# EAGLE design BMS Schematic (EAGLE 8.4.1)

## Sheet 1 of 3
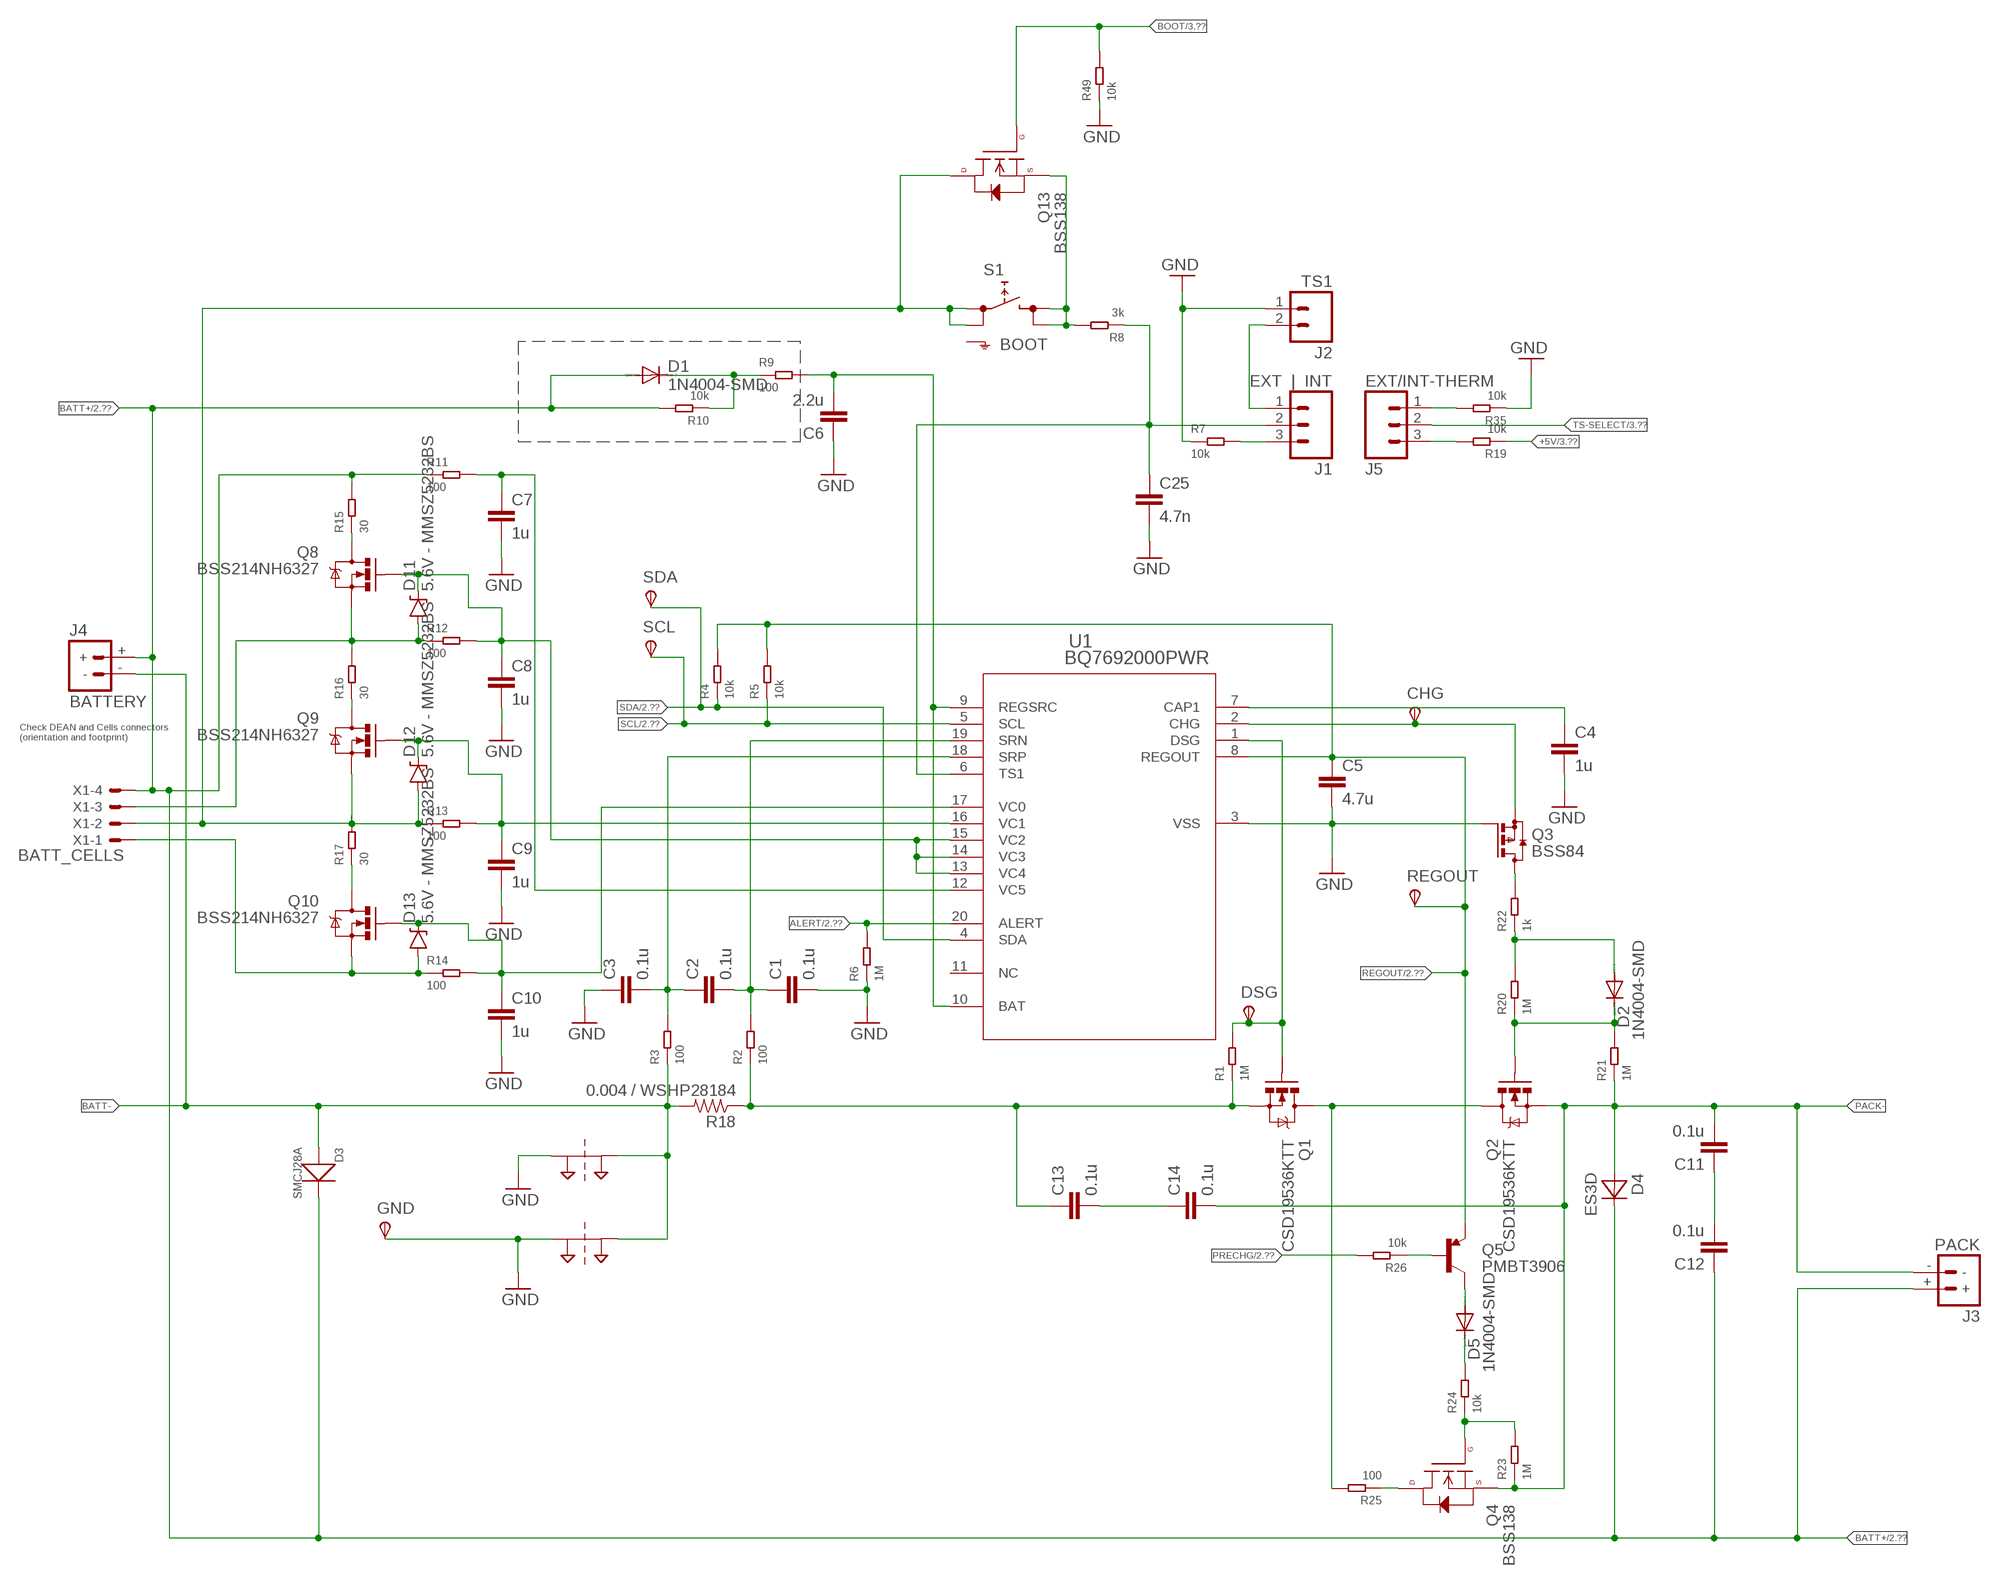
[diagram p0: schematic, sheet 1]

### Parts
C1  0.1u  CAP0805  [0805]
C2  0.1u  CAP0805  [0805]
C3  0.1u  CAP0805  [0805]
C4  1u  CAP0805  [0805]
C5  4.7u  CAP0805  [0805]
C6  2.2u  C-EUC1206  [C1206]
C7  1u  CAP0805  [0805]
C8  1u  CAP0805  [0805]
C9  1u  CAP0805  [0805]
C10  1u  CAP0805  [0805]
C11  0.1u  CAP0805  [0805]
C12  0.1u  CAP0805  [0805]
C13  0.1u  CAP0805  [0805]
C14  0.1u  CAP0805  [0805]
C25  4.7n  CAP0805  [0805]
CHG  TPSB2,54  [B2,54]
D1  1N4004-SMD  [DO-214]
D2  1N4004-SMD  [DO-214]
D3  SMCJ28A  SMD-DIODE-SCHOTTKY-40V-3A(DO-214AB)  [DO-214AB]
D4  ES3D  [SMC]
D5  1N4004-SMD  [DO-214]
D11  5.6V - MMSZ5232BS  DIODE-ZENER5.6V  [SOD-323]
D12  5.6V - MMSZ5232BS  DIODE-ZENER5.6V  [SOD-323]
D13  5.6V - MMSZ5232BS  DIODE-ZENER5.6V  [SOD-323]
DSG  TPSB2,54  [B2,54]
GND  GND  TPSPAD1-17  [P1-17]
J1  EXT | INT  M03PTH  [1X03]
J2  TS1  M02PTH  [1X02]
J3  PACK  BATTERY_CONNDEANS  [DEANS]
J4  BATTERY  BATTERY_CONNDEANS  [DEANS]
J5  EXT/INT-THERM  M03PTH  [1X03]
PT1  2PT_GND_TIE  [2PT_GND_TIE]
PT2  2PT_GND_TIE  [2PT_GND_TIE]
Q1  CSD19536KTT  MOSFET-NCHANNELPSMN7R0  [TO-263/D2PAK]
Q2  CSD19536KTT  MOSFET-NCHANNELPSMN7R0  [TO-263/D2PAK]
Q3  BSS84  [SOT23]
Q4  BSS138  N-CHANNEL-MOSFET-BSS138  [SOT23-3]
Q5  PMBT3906  TRANSISTOR_PNPPMBT3906  [SOT23-3]
Q8  BSS214NH6327  MOSFET-NCHANNELBSS138  [SOT23-3]
Q9  BSS214NH6327  MOSFET-NCHANNELBSS138  [SOT23-3]
Q10  BSS214NH6327  MOSFET-NCHANNELBSS138  [SOT23-3]
Q13  BSS138  N-CHANNEL-MOSFET-BSS138  [SOT23-3]
R1  1M  RES-0805  [R0805]
R2  100  RES-0805  [R0805]
R3  100  RES-0805  [R0805]
R4  10k  RES-0805  [R0805]
R5  10k  RES-0805  [R0805]
R6  1M  RES-0805  [R0805]
R7  10k  RES-0805  [R0805]
R8  3k  RES-0805  [R0805]
R9  100  RES-0805  [R0805]
R10  10k  RES-0805  [R0805]
R11  100  RES-0805  [R0805]
R12  100  RES-0805  [R0805]
R13  100  RES-0805  [R0805]
R14  100  RES-0805  [R0805]
R15  30  RES-2512  [R2512]
R16  30  RES-2512  [R2512]
R17  30  RES-2512  [R2512]
R18  0.004 / WSHP28184  0.001OHM-3W-1%(2512)3W/1%  [2512]
R19  10k  RES-0805  [R0805]
R20  1M  RES-0805  [R0805]
R21  1M  RES-0805  [R0805]
R22  1k  RES-0805  [R0805]
R23  1M  RES-0805  [R0805]
R24  10k  RES-0805  [R0805]
R25  100  RES-2512  [R2512]
R26  10k  RES-0805  [R0805]
R35  10k  RES-0805  [R0805]
R49  10k  RES-0805  [R0805]
REGOUT  TPSB2,54  [B2,54]
S1  BOOT  SKHMPSE010  [SKHMPXE010]
SCL  TPSB2,54  [B2,54]
SDA  TPSB2,54  [B2,54]
U1  BQ7692000PWR  BQ7692006PWR  [PW20]
X1  BATT_CELLS  C-GRID-04-70543  [70543-04]

### Nets
+5V: R19.1 ; also sheet 3
ALERT: R6.2 U1.20(ALERT) ; also sheet 2
BATT+: C12.1 D1.A D3.2(-) D4.C J3.+ J4.+ R10.2 R11.1 R15.2 X1.4 ; also sheet 2,3
BATT-: D3.1(+) J4.- PT1.P$2 PT2.P$2 R3.1 R18.2
BOOT: Q13.1(G) R49.2 ; also sheet 3
CHG: CHG.TP(PP) Q3.2(S) U1.2(CHG)
DSG: DSG.TP(PP) Q1.1(G) R1.2 U1.1(DSG)
DSG-CHG: Q1.2(D) Q2.2(D) R25.2
GND: C1.2 C3.1 C4.2 C5.2 C6.1 C7.2 C8.2 C9.2 C10.2 C25.2 GND.TP(PP) J2.1 PT1.P$1 PT2.P$1 Q3.1(G) R6.1 R7.1 R35.1 R49.1 U1.3(VSS) ; also sheet 2,3
N$1: C2.1 C3.2 R3.2 U1.18(SRP)
N$2: C1.1 C2.2 R2.2 U1.19(SRN)
N$3: C25.1 J1.2 R8.1 U1.6(TS1)
N$4: C6.2 R9.2 U1.9(REGSRC) U1.10(BAT)
N$5: C4.1 U1.7(CAP1)
N$8: J1.1 J2.2
N$9: J1.3 R7.2
N$10: D1.C R9.1 R10.1
N$11: Q13.2(S) R8.2 S1.3(2.1) S1.4(2.2)
N$12: D13.A Q10.2(S) R14.1 X1.1
N$13: C7.1 R11.2 U1.12(VC5)
N$14: Q8.3(D) R15.1
N$16: C10.1 D13.C Q10.1(G) R14.2 U1.17(VC0)
N$17: J5.3 R19.2
N$18: D11.A Q8.2(S) R12.1 R16.2 X1.3
N$19: Q9.3(D) R16.1
N$20: D2.C Q2.1(G) R20.1 R21.2
N$21: C8.1 D11.C Q8.1(G) R12.2 U1.13(VC4) U1.14(VC3) U1.15(VC2)
N$22: Q10.3(D) R17.1
N$24: C11.1 C12.2
N$26: D2.A R20.2 R22.1
N$27: D12.A Q9.2(S) Q13.3(D) R13.1 R17.2 S1.1(1.1) S1.2(1.2) X1.2
N$28: Q3.3(D) R22.2
N$29: C13.2 C14.1
N$30: Q4.1(G) R23.2 R24.1
N$31: D5.C R24.2
N$32: D5.A Q5.3(C)
N$33: Q5.1(B) R26.1
N$34: Q4.3(D) R25.1
N$57: J5.1 R35.2
N$67: C9.1 D12.C Q9.1(G) R13.2 U1.16(VC1)
PACK-: C11.2 C14.2 D4.A J3.- Q2.3(S) Q4.2(S) R21.1 R23.1
PRECHG: R26.2 ; also sheet 2
REGOUT: C5.1 Q5.2(E) R4.2 R5.2 REGOUT.TP(PP) U1.8(REGOUT) ; also sheet 2,3
RSNS-DSG: C13.1 Q1.3(S) R1.1 R2.1 R18.1
SCL: R5.1 SCL.TP(PP) U1.5(SCL) ; also sheet 2
SDA: R4.1 SDA.TP(PP) U1.4(SDA) ; also sheet 2
TS-SELECT: J5.2 ; also sheet 3
Unconnected: S1.5(SH) U1.11(NC)

### Notes on the sheet
- Check DEAN and Cells connectors 
  (orientation and footprint)

## Sheet 2 of 3
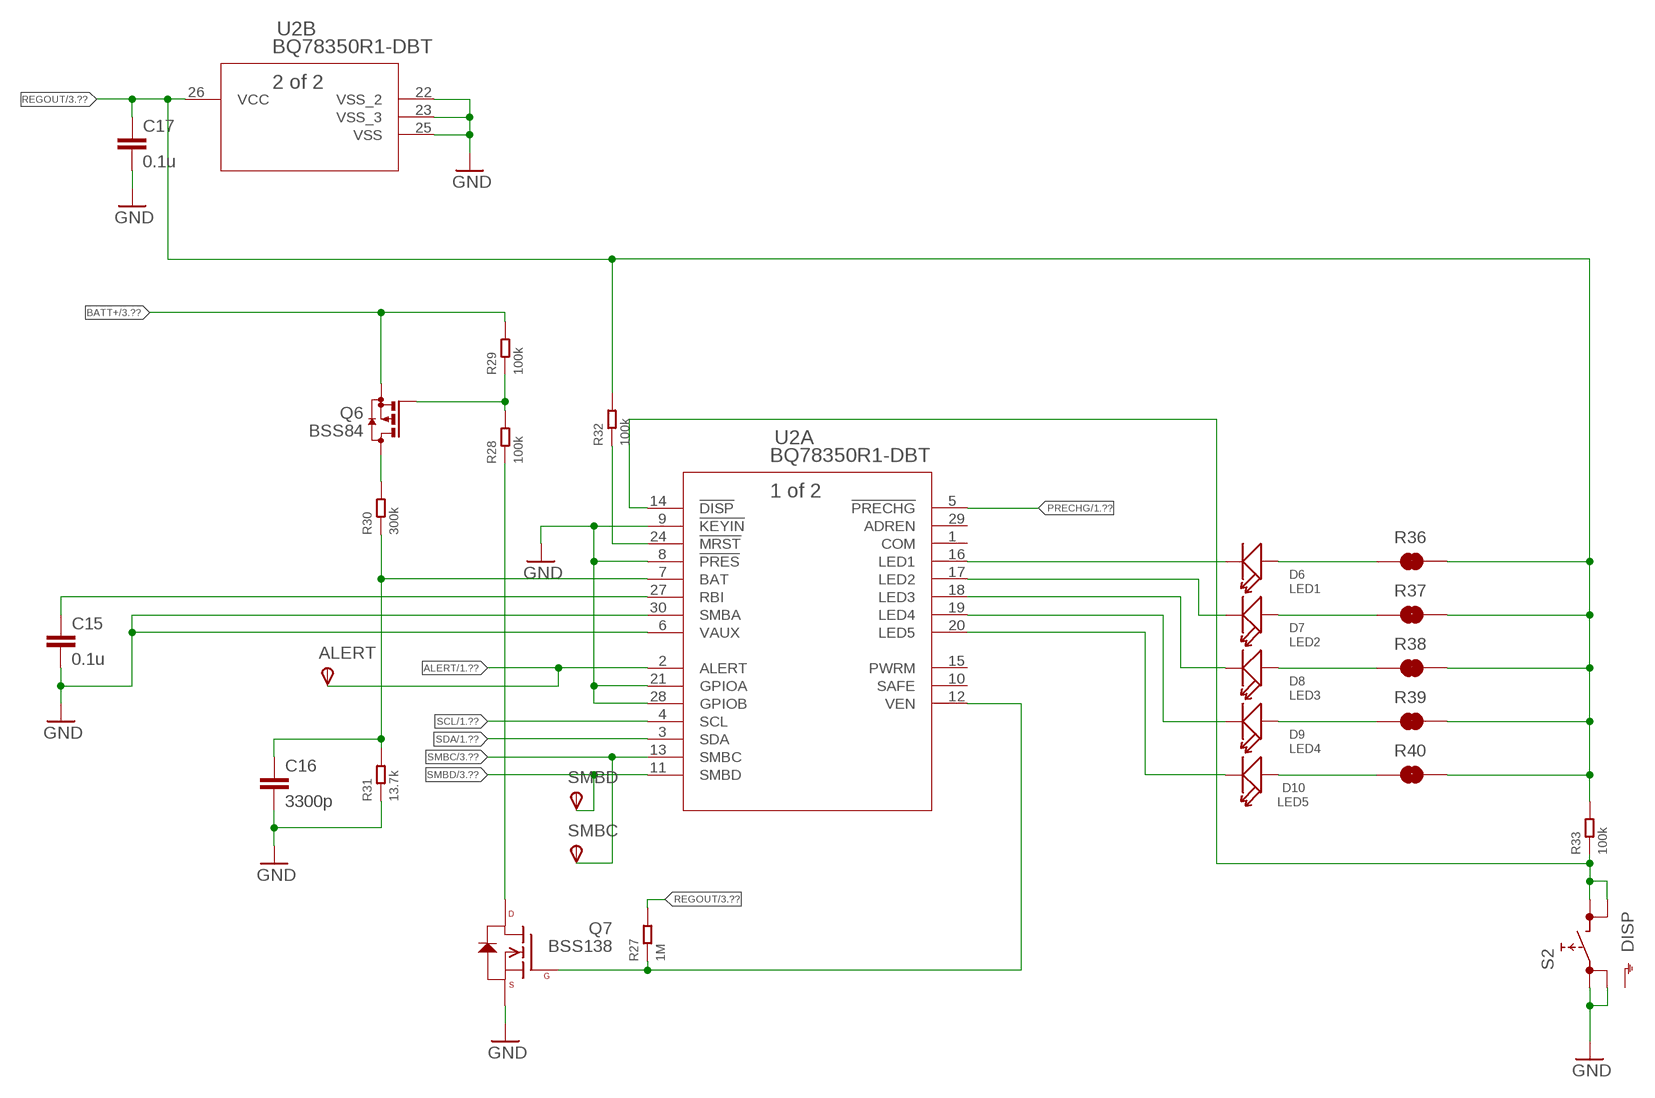
[diagram p1: schematic, sheet 2]

### Parts
ALERT  TPSB2,54  [B2,54]
C15  0.1u  CAP0805  [0805]
C16  3300p  CAP0805  [0805]
C17  0.1u  CAP0805  [0805]
D6  LED1  SMD-LED-CLEAR-GREEN(0805)  [LED-0805]
D7  LED2  SMD-LED-CLEAR-GREEN(0805)  [LED-0805]
D8  LED3  SMD-LED-CLEAR-GREEN(0805)  [LED-0805]
D9  LED4  SMD-LED-CLEAR-GREEN(0805)  [LED-0805]
D10  LED5  SMD-LED-CLEAR-RED(0805)  [LED-0805]
Q6  BSS84  [SOT23]
Q7  BSS138  N-CHANNEL-MOSFET-BSS138  [SOT23-3]
R27  1M  RES-0805  [R0805]
R28  100k  RES-0805  [R0805]
R29  100k  RES-0805  [R0805]
R30  300k  RES-0805  [R0805]
R31  13.7k  RES-0805  [R0805]
R32  100k  RES-0805  [R0805]
R33  100k  RES-0805  [R0805]
R36  JUMPER-NC-0805  [R0805]
R37  JUMPER-NC-0805  [R0805]
R38  JUMPER-NC-0805  [R0805]
R39  JUMPER-NC-0805  [R0805]
R40  JUMPER-NC-0805  [R0805]
S2  DISP  SKHMPSE010  [SKHMPXE010]
SMBC  TPSB2,54  [B2,54]
SMBD  TPSB2,54  [B2,54]
U2  BQ78350R1-DBT  [DBT30]

### Nets
ALERT: ALERT.TP(PP) U2.2(A:ALERT) ; also sheet 1
BATT+: Q6.2(S) R29.2 ; also sheet 1,3
GND: C15.2 C16.2 C17.2 Q7.2(S) R31.1 S2.1(1.1) S2.2(1.2) U2.6(A:VAUX) U2.8(A:!PRES) U2.9(A:!KEYIN) U2.21(A:GPIOA) U2.22(B:VSS_2) U2.23(B:VSS_3) U2.25(B:VSS) U2.28(A:GPIOB) U2.30(A:SMBA) ; also sheet 1,3
N$23: C15.1 U2.27(A:RBI)
N$35: Q7.1(G) R27.1 U2.12(A:VEN)
N$36: Q7.3(D) R28.1
N$37: Q6.1(G) R28.2 R29.1
N$38: Q6.3(D) R30.2
N$39: C16.1 R30.1 R31.2 U2.7(A:BAT)
N$40: R32.1 U2.24(A:!MRST)
N$41: D6.- U2.16(A:LED1)
N$42: D7.- U2.17(A:LED2)
N$43: D8.- U2.18(A:LED3)
N$44: D9.- U2.19(A:LED4)
N$45: D10.- U2.20(A:LED5)
N$46: D6.+ R36.1
N$47: D7.+ R37.1
N$48: R33.1 S2.3(2.1) S2.4(2.2) U2.14(A:!DISP)
N$49: D8.+ R38.1
N$50: D9.+ R39.1
N$51: D10.+ R40.1
PRECHG: U2.5(A:!PRECHG) ; also sheet 1
REGOUT: C17.1 R27.2 R32.2 R33.2 R36.2 R37.2 R38.2 R39.2 R40.2 U2.26(B:VCC) ; also sheet 1,3
SCL: U2.4(A:SCL) ; also sheet 1
SDA: U2.3(A:SDA) ; also sheet 1
SMBC: SMBC.TP(PP) U2.13(A:SMBC) ; also sheet 3
SMBD: SMBD.TP(PP) U2.11(A:SMBD) ; also sheet 3
Unconnected: S2.5(SH) U2.1(A:COM) U2.10(A:SAFE) U2.15(A:PWRM) U2.29(A:ADREN)

## Sheet 3 of 3
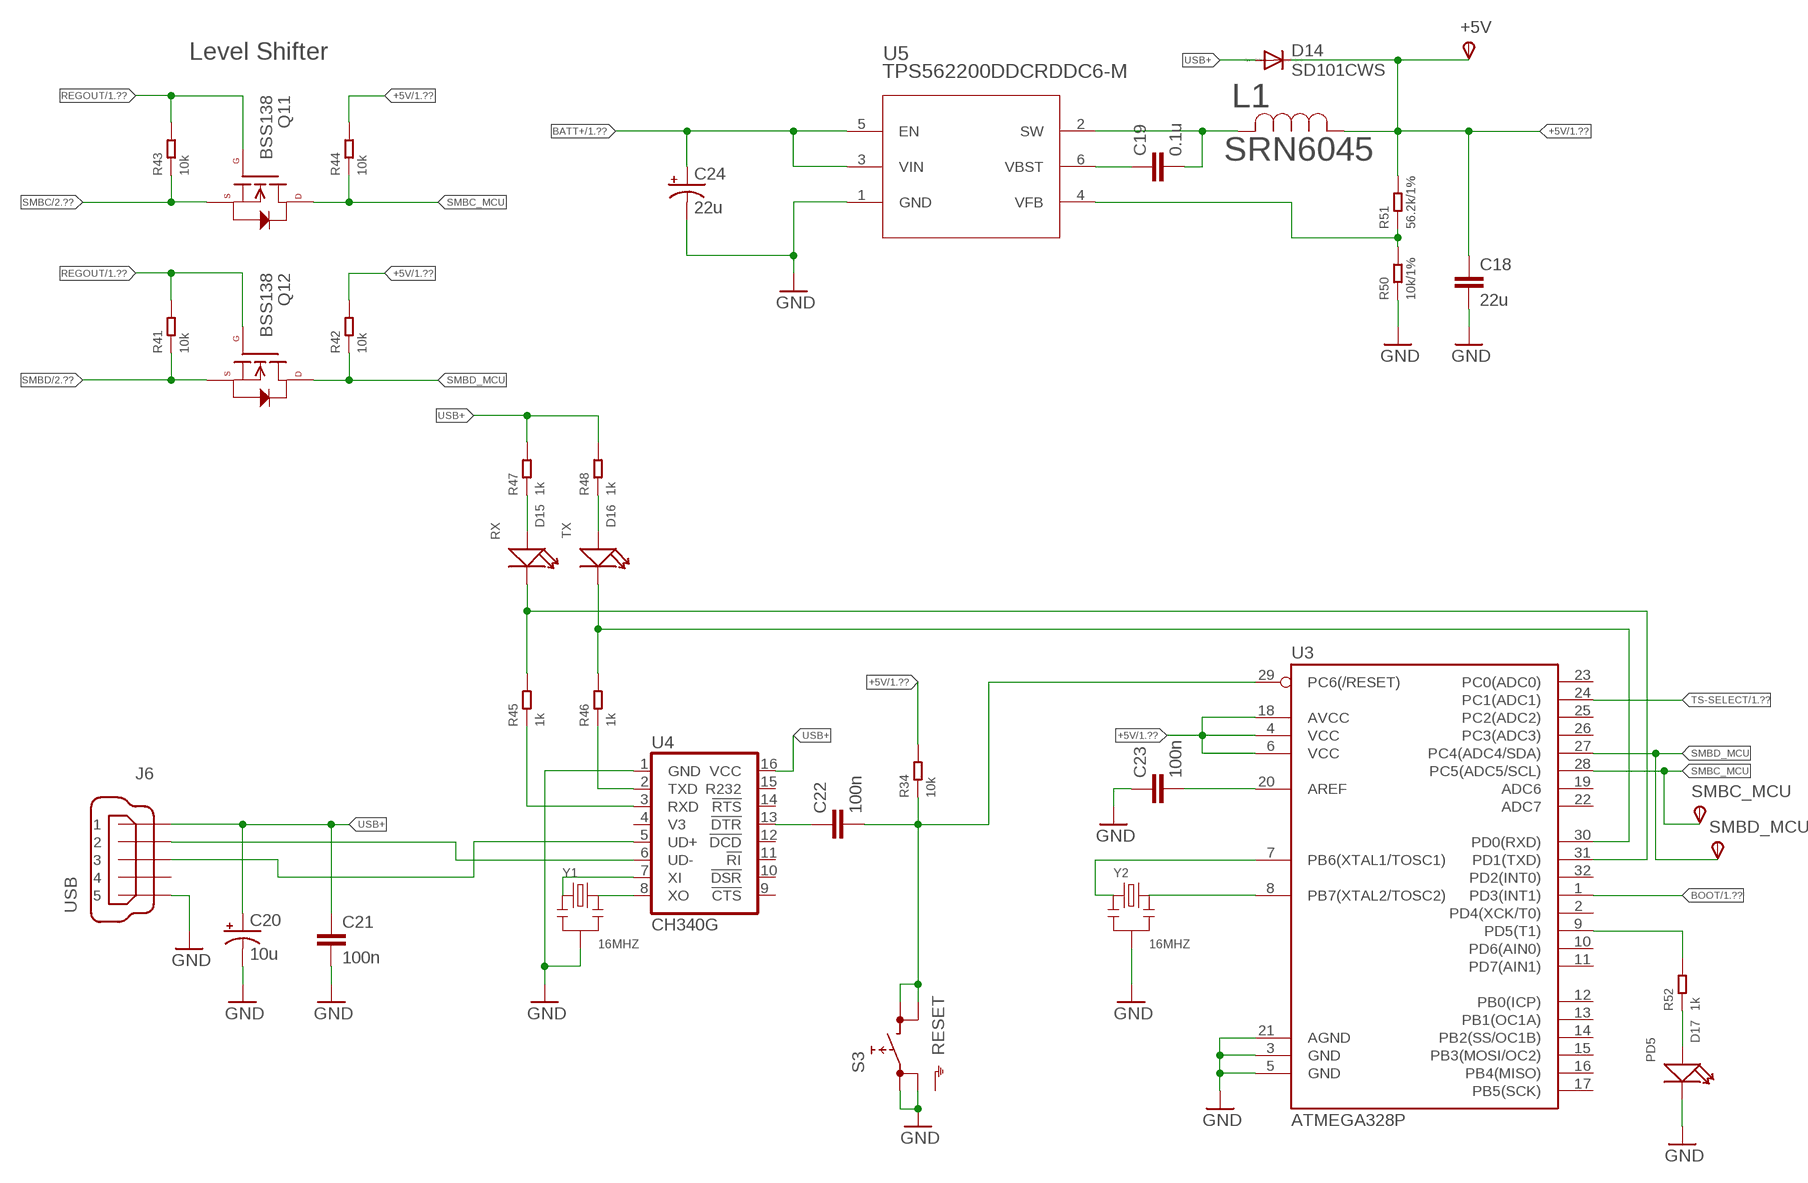
[diagram p2: schematic, sheet 3]

### Parts
+5V  TPSB2,54  [B2,54]
C18  22u  CAP0805  [0805]
C19  0.1u  CAP0805  [0805]
C20  10u  CAP_POL1206-KIT  [EIA3216-KIT]
C21  100n  CAP0603-CAP  [0603-CAP]
C22  100n  CAP0603-CAP  [0603-CAP]
C23  100n  CAP0603-CAP  [0603-CAP]
C24  22u  CAP_POLC  [PANASONIC_C]
D14  SD101CWS  DIODE-SOD323-W  [SOD323-W]
D15  RX  SMD-LED-CLEAR-GREEN(0805)  [LED-0805]
D16  TX  SMD-LED-CLEAR-GREEN(0805)  [LED-0805]
D17  PD5  SMD-LED-CLEAR-GREEN(0805)  [LED-0805]
J6  USB  MINI-USB-ARDUINO-NANO  [USB-MINI-B_2]
L1  SRN6045  BOURNS_SRN6045  [IND_BOURNS_SRN6045]
Q11  BSS138  N-CHANNEL-MOSFET-BSS138  [SOT23-3]
Q12  BSS138  N-CHANNEL-MOSFET-BSS138  [SOT23-3]
R34  10k  RES-0805  [R0805]
R41  10k  RES-0805  [R0805]
R42  10k  RES-0805  [R0805]
R43  10k  RES-0805  [R0805]
R44  10k  RES-0805  [R0805]
R45  1k  RES-0805  [R0805]
R46  1k  RES-0805  [R0805]
R47  1k  RES-0805  [R0805]
R48  1k  RES-0805  [R0805]
R50  10k/1%  RES-0805  [R0805]
R51  56.2k/1%  RES-0805  [R0805]
R52  1k  RES-0805  [R0805]
S3  RESET  SKHMPSE010  [SKHMPXE010]
SMBC_MCU  TPSB2,54  [B2,54]
SMBD_MCU  TPSB2,54  [B2,54]
U3  ATMEGA328P  ATMEGA328P_TQFP  [TQFP32-08]
U4  CH340G  CH340GSMD  [SO016]
U5  TPS562200DDCRDDC6-M  [DDC6-M]
Y1  16MHZ  SMD-RESONATOR-16MHZ-15PF-0.5%-40R(3P-3.2X1.3MM)  [X3-SMD-3.6X1.3X0.8MM]
Y2  16MHZ  SMD-RESONATOR-16MHZ-15PF-0.5%-40R(3P-3.2X1.3MM)  [X3-SMD-3.6X1.3X0.8MM]

### Nets
+5V: +5V.TP(PP) C18.1 D14.C L1.1 R34.2 R42.2 R44.2 R51.2 U3.4(VCC) U3.6(VCC) U3.18(AVCC) ; also sheet 1
BATT+: C24.+ U5.3(VIN) U5.5(EN) ; also sheet 1,2
BOOT: U3.1(PD3(INT1)) ; also sheet 1
GND: C18.2 C20.C(-) C21.2 C23.1 C24.- D17.- J6.1 R50.1 S3.1(1.1) S3.2(1.2) U3.3(GND) U3.5(GND) U3.21(AGND) U4.1(GND) U5.1(GND) Y1.2 Y2.2 ; also sheet 1,2
N$6: J6.4 U4.6(UD-)
N$7: J6.3 U4.5(UD+)
N$15: D15.+ R47.1
N$53: D16.+ R48.1
N$55: C22.1 U4.13(!DTR)
N$56: C22.2 R34.1 S3.3(2.1) S3.4(2.2) U3.29(PC6(/RESET))
N$58: U4.7(XI) Y1.1
N$59: U4.8(XO) Y1.3
N$60: R45.1 U4.3(RXD)
N$61: U3.8(PB7(XTAL2/TOSC2)) Y2.3
N$62: U3.7(PB6(XTAL1/TOSC1)) Y2.1
N$63: R46.1 U4.2(TXD)
N$64: D15.- R45.2 U3.31(PD1(TXD))
N$65: D16.- R46.2 U3.30(PD0(RXD))
N$66: C23.2 U3.20(AREF)
N$68: R50.2 R51.1 U5.4(VFB)
N$70: C19.1 U5.6(VBST)
N$71: R52.2 U3.9(PD5(T1))
N$72: D17.+ R52.1
REGOUT: Q11.1(G) Q12.1(G) R41.2 R43.2 ; also sheet 1,2
SMBC: Q11.2(S) R43.1 ; also sheet 2
SMBC_MCU: Q11.3(D) R44.1 SMBC_MCU.TP(PP) U3.28(PC5(ADC5/SCL))
SMBD: Q12.2(S) R41.1 ; also sheet 2
SMBD_MCU: Q12.3(D) R42.1 SMBD_MCU.TP(PP) U3.27(PC4(ADC4/SDA))
SW: C19.2 L1.2 U5.2(SW)
TS-SELECT: U3.24(PC1(ADC1)) ; also sheet 1
USB+: C20.A(+) C21.1 D14.A J6.5 R47.2 R48.2 U4.16(VCC)
Unconnected: J6.2 S3.5(SH) U3.2(PD4(XCK/T0)) U3.10(PD6(AIN0)) U3.11(PD7(AIN1)) U3.12(PB0(ICP)) U3.13(PB1(OC1A)) U3.14(PB2(SS/OC1B)) U3.15(PB3(MOSI/OC2)) U3.16(PB4(MISO)) U3.17(PB5(SCK)) U3.19(ADC6) U3.22(ADC7) U3.23(PC0(ADC0)) U3.25(PC2(ADC2)) U3.26(PC3(ADC3)) U3.32(PD2(INT0)) U4.4(V3) U4.9(!CTS) U4.10(!DSR) U4.11(!RI) U4.12(!DCD) U4.14(!RTS) U4.15(R232)

### Notes on the sheet
- Level Shifter

## Library data of the parts
+5V ALERT CHG DSG REGOUT SCL SDA SMBC SMBC_MCU SMBD SMBD_MCU = testpad:TPS: TEST PIN
C1-C5 C7-C19 C21-C23 C25 = SparkFun-Passives:CAP: Capacitor Standard 0603 ceramic capacitor, and 0.1" leaded capacitor.
C6 = resistor:C-EU: CAPACITOR, European symbol
C20 C24 = SparkFun-Capacitors:CAP_POL: Capacitor Polarized These are standard SMD and PTH capacitors. Normally 10uF, 47uF, and 100uF in electrolytic and tantalum varieties. Always verify the external diameter of the through hole cap, it varies with capacity, voltage, and manufacturer. The EIA devices should be standard.
D1 D2 D5 = 0_Club_robot:1N4004: DIODE general purpose rectifier, 1 A
D3 = Seeed-OPL-Diode:SMD-DIODE-SCHOTTKY-40V-3A(DO-214AB): 304020018; MPN: SS34-E3/57T; VALUE: 40V-3A
D4 = 0_Club_robot:ES3D: Rectifier diode 3A 200V
D6-D9 D15-D17 = Seeed-OPL-Diode:SMD-LED-CLEAR-GREEN(0805): 304090057; MPN: 17-215SYGC/S530-E2/TR8; VALUE: GREEN-0805
D10 = Seeed-OPL-Diode:SMD-LED-CLEAR-RED(0805): 304090046; MPN: 17-215SURC/S530-A2/TR8; VALUE: RED-0805
D11-D13 = SparkFun-DiscreteSemi:DIODE-ZENER: Zener Diode Production Part - 8199 3.4V Zener Voltage; PROD_ID: DIO-12442; VALUE: 5.6V
D14 = diode:DIODE-: DIODE
GND = testpad:TPS: TEST PIN; SPICEPREFIX: X
J1 J5 = SparkFun-Connectors:M03: Header 3 Standard 3-pin 0.1" header. Use with straight break away headers (SKU : PRT-00116), right angle break away headers (PRT-00553), swiss pins (PRT-00743), machine pins (PRT-00117), and female headers (PRT-00115). Molex polarized connector foot print use with SKU : PRT-08232 with associated crimp pins and housings.
J2 = SparkFun-Connectors:M02: Standard 2-pin 0.1" header. Use with - straight break away headers ( PRT-00116) - right angle break away headers (PRT-00553) - swiss pins (PRT-00743) - machine pins (PRT-00117) - female headers (PRT-00115) Molex polarized connector foot print use with: PRT-08233 with associated crimp pins and housings. 2.54_SCREWTERM for use with PRT-10571. 3.5mm Screw Terminal footprints for PRT-08084 5mm Screw Terminal footprints for use with PRT-08432
J3 J4 = SparkFun-Connectors:BATTERY_CONN: Various footprints for battery connectors
J6 = MyCON2:MINI-USB-ARDUINO-NANO
L1 = inductanceBuck:BOURNS_SRN6045
PT1 PT2 = SparkFun-Passives:2PT_GND_TIE: Package for connecting two ground nets in one place.
Q1 Q2 = SparkFun-DiscreteSemi:MOSFET-NCHANNEL: Common NMOSFET Parts MFG P/N Store ID Prod ID FDD8780 TRANS-09984 SI7820DN TRANS-11055 FDS6630A IC-08089 2N7002PW TRANS-11151 FQP30N06L COM-10213 TRANS-10060 BSS123LT1G TRANS-08345 BSS138 TRANS-00830 BS170 2N7000; PROD_ID: TRANS-12437; VALUE: 100A/100V
Q3 Q6 = transistor-small-signal:BSS84: P-CHANNEL MOS FET
Q4 Q7 Q11-Q13 = GeekAmmo:N-CHANNEL-MOSFET: N-Channel MOSFET Mode Field Effect Transistor; DATASHEET: http://www.fairchildsemi.com/ds/BS/BSS138.pdf; DIGIKEY: BSS138TR-ND; ELEMENT14: 2323154; URL: http://au.element14.com/fairchild-semiconductor/bss138/mosfet-n-ch-50v-220ma-sot-23/dp/2323154
Q5 = SparkFun-DiscreteSemi:TRANSISTOR_PNP: Generic PNP BJT Double check pinouts against datasheets- not all devices are the same! MMBT3906 - 40V 200mA SOT-23 (TRANS-08052) MMBT4403 - 40V 600mA SOT-23 (TRANS-09245); PROD_ID: TRANS-08052
Q8-Q10 = SparkFun-DiscreteSemi:MOSFET-NCHANNEL: Common NMOSFET Parts MFG P/N Store ID Prod ID FDD8780 TRANS-09984 SI7820DN TRANS-11055 FDS6630A IC-08089 2N7002PW TRANS-11151 FQP30N06L COM-10213 TRANS-10060 BSS123LT1G TRANS-08345 BSS138 TRANS-00830 BS170 2N7000; PROD_ID: TRANS-00830; VALUE: 200mA/50V
R1-R17 R19-R35 R41-R52 = Seeed-OPL-Resistor:RES
R18 = SparkFun-Resistors:0.001OHM-3W-1%(2512); PROD_ID: RES-12449; VALUE: 0.001
R36-R40 = Jumper0805:JUMPER-NC-0805
S1-S3 = switch:SKHMP*E010: 6.2 X 6.5mm TACT Switch (SMD) Source: http://www3.alps.co.jp/WebObjects/catalog.woa/PDF/E/Switch/Tact/SKHM/SKHM.PDF
U1 = BQ76920:BQ7692006PWR; MANUFACTURER_PART_NUMBER: BQ7692006PWR; VENDOR: Texas Instruments
U2 = bq78350:BQ78350R1-DBT; MANUFACTURER_PART_NUMBER: BQ78350DBT; VENDOR: Texas Instruments
U3 = SparkFun-DigitalIC:ATMEGA328P_TQFP; PROD_ID: IC-09069; VALUE: ATMEGA328P_TQFP
U4 = Serial-Basic:CH340G: A simple USB 2.0 to Serial IC.; PROD_ID: IC-13498
U5 = TPS562200:TPS562200DDCR; MANUFACTURER_PART_NUMBER: TPS562200DDCR; VENDOR: Texas Instruments
X1 = con-molex:C-GRID-04: CONNECTOR wire to board 2.54 mm (0.100") pitch header; OC_FARNELL: unknown; OC_NEWARK: unknown
Y1 Y2 = Seeed-OPL-Crystal-Oscillator:SMD-RESONATOR-16MHZ-15PF-0.5%-40R(3P-3.2X1.3MM): 306030002; MPN: CSTCE16M0V53-R0

## Board
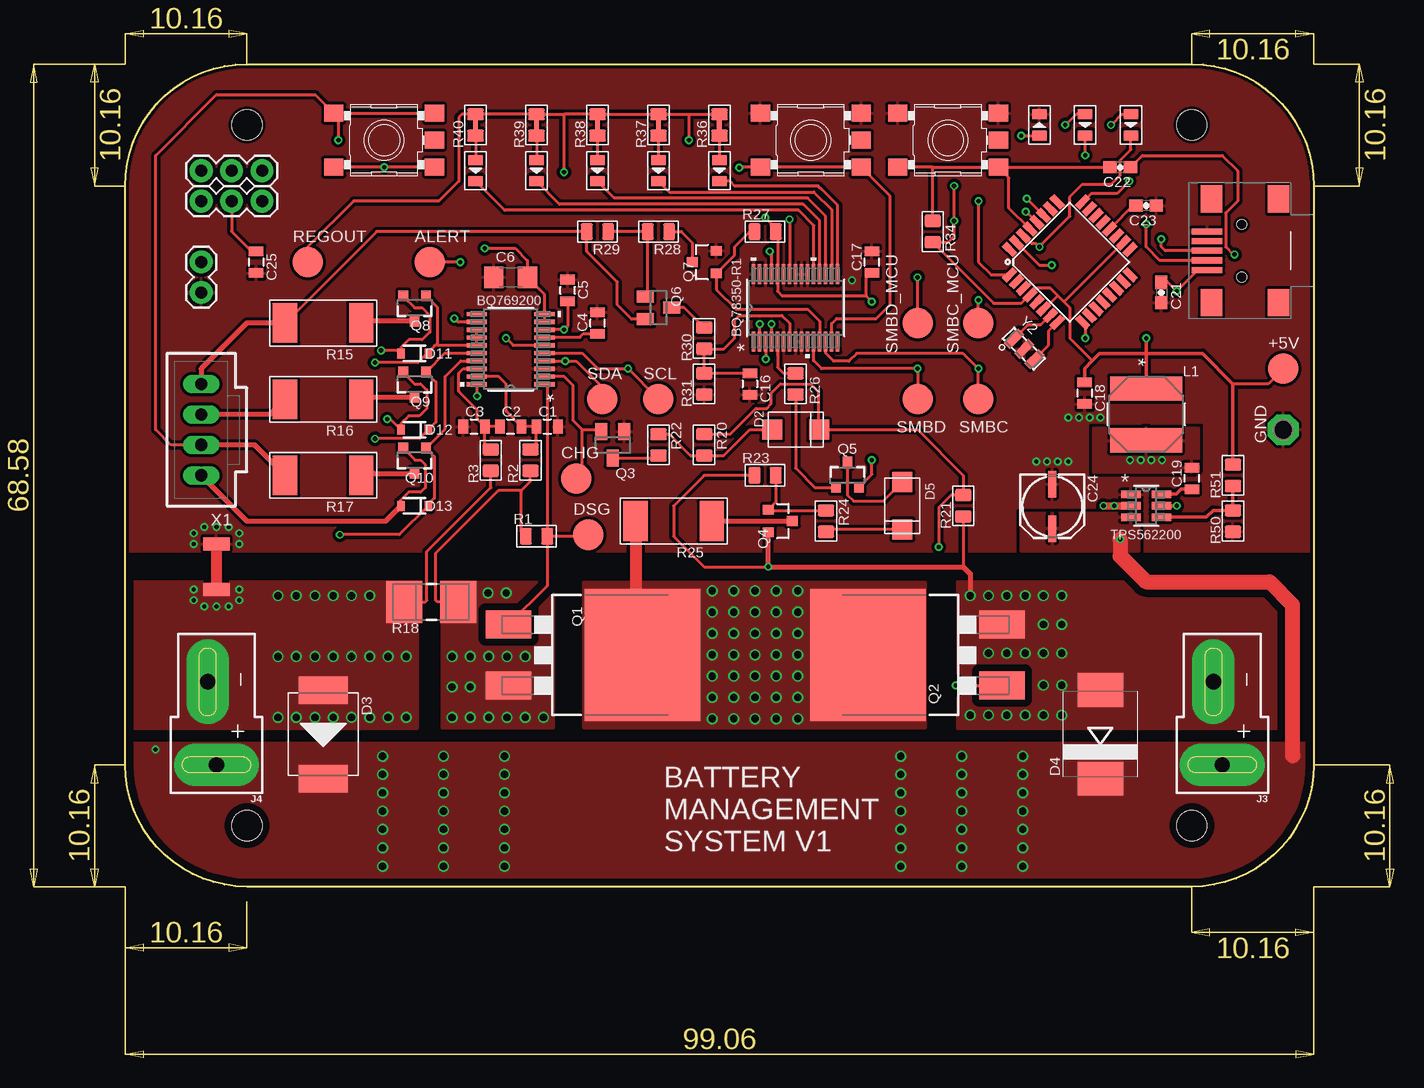
[diagram p3: board, top side]
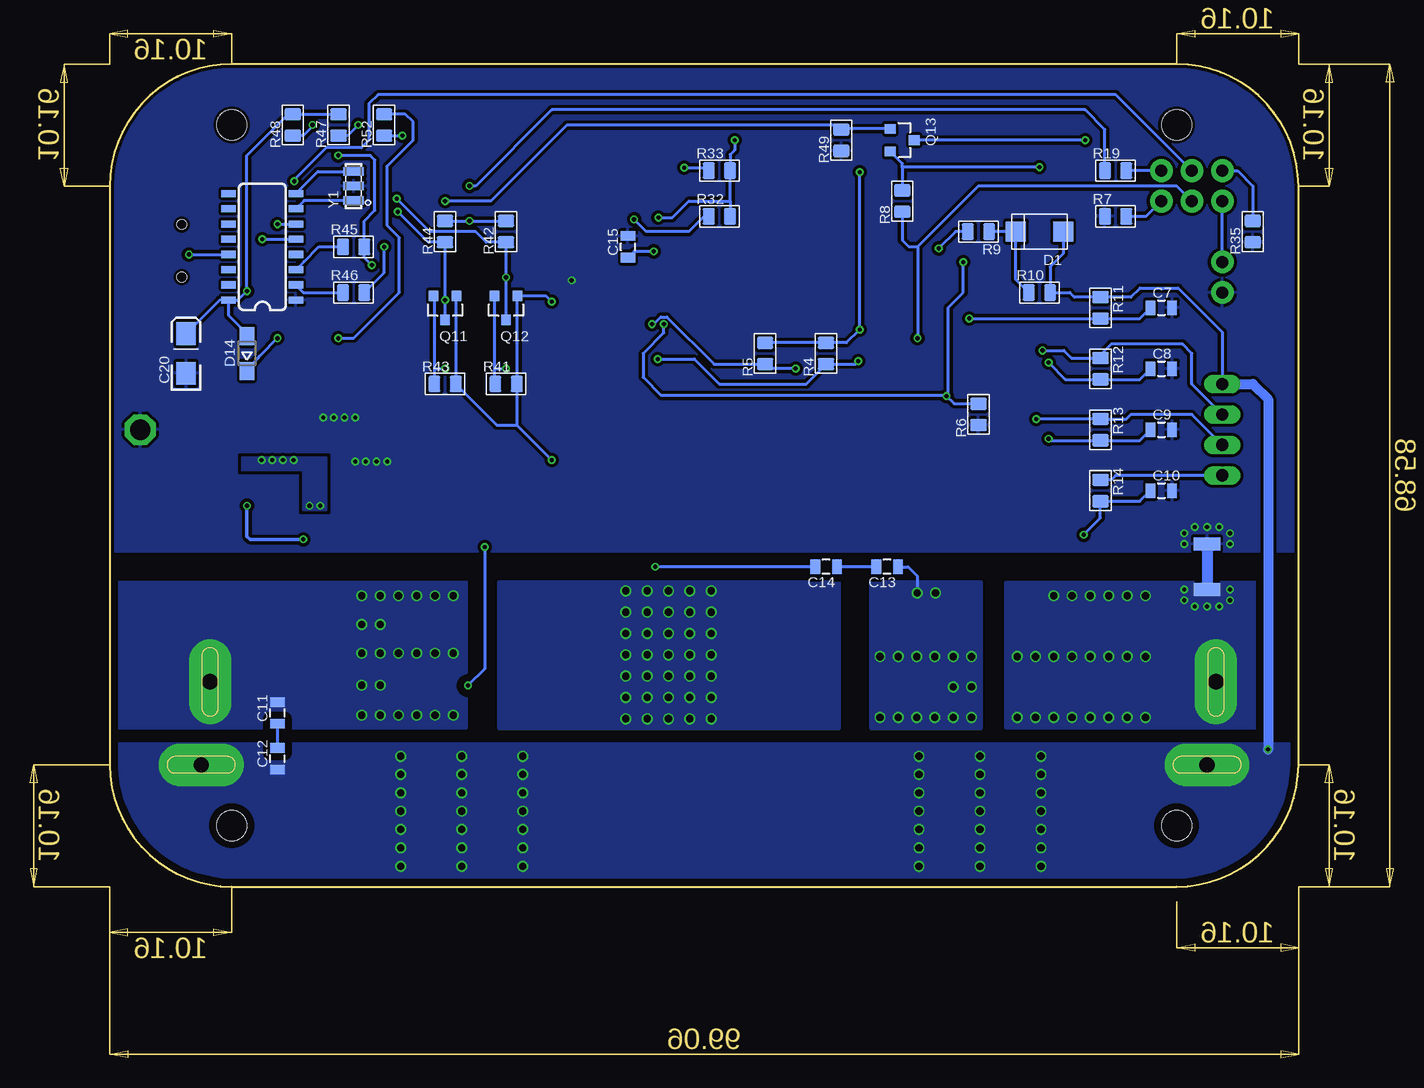
[diagram p4: board, bottom side, seen from below]

Size 99.06 x 68.58 mm. Coordinates in mm from the lower left corner, seen from the top.
Outline: 10.16,0 arc-90 0,10.16 0,58.42 arc-90 10.16,68.58 88.9,68.58 arc-90 99.06,58.42 99.06,10.16 arc-90 88.9,0 10.16,0
Copper layers (1*16): Top 0.035mm / dielectric 1.5mm / Bottom 0.035mm
Design rules "SeeedStudio_2layer_DRU_no_angle_20140221": minimum track width 6mil, minimum drill 12mil, track to track 6mil, track to pad 6mil, pad to pad 6mil, via to via 6mil, smd to smd 0mil, copper to edge 10mil, drill to drill 10mil, minimum pad ring 10mil, minimum via ring 6mil, stop-mask expansion 2mil, vias tented up to drill 100mil, thermal gap 10mil
Holes 2.5 mm at 10.16,5.08 10.16,63.5 88.9,5.08 88.9,63.5

### Footprints (pad centres in the part's own frame; a part is rotated, then mirrored left to right if it is on the bottom)
B2,54 = smd 2.54 x 2.54: TP 0,0
0805 = smd 0.8 x 1.2: 1 -0.9,0; 2 0.9,0
C1206 = smd 1.6 x 1.8: 1 -1.4,0; 2 1.4,0
EIA3216-KIT = smd 1.9 x 1.6: A 1.65,0; C -1.65,0
0603-CAP = smd 1.1 x 1: 1 -0.85,0; 2 0.85,0
PANASONIC_C = smd 2.2 x 0.65: + 1.9,-0.2; - -1.8,-0.2
DO-214 = smd 1.67 x 1.67: A -1.965,0; C 1.965,0
DO-214AB = smd 2.286 x 4.064: 1 -3.683,0; 2 3.683,0
SMC = smd 2.8 x 3.8: A 3.7,0; C -3.7,0
LED-0805 = smd 0.889 x 1.27: + -0.889,0; - 0.889,0
SOD-323 = smd 0.63 x 0.83: A 1.15,0; C -1.15,0
SOD323-W = smd 1.5 x 1.2: A 1.45,0; C -1.45,0
P1-17 = drill 1.702 pad 2.54 octagon: TP 0,0
1X03 = drill 1.016 pad 1.88: 1 0,0; 2 2.54,0; 3 5.08,0
1X02 = drill 1.016 pad 1.88: 1 0,0; 2 2.54,0
DEANS = drill 1.27 pad 3.556 long: + 0,0; - 0.737,-6.921
USB-MINI-B_2 = smd 0.508 x 2.54: 1 0,0; 2 0.8,0; 3 1.6,0; 4 2.4,0; 5 3.2,0 | smd 2.286 x 1.778: 6 -2.717,5.948; 7 -2.717,0.36; 8 5.918,0.36; 9 5.918,5.948 | hole 0.813: -0.6,2.9; 3.8,2.9
IND_BOURNS_SRN6045 = smd 2.007 x 5.994: 1 -2.159,0; 2 2.159,0
2PT_GND_TIE = smd 2.184 x 1.067: P$1 0,1.905; P$2 0,-1.905
TO-263/D2PAK = smd 2.32 x 3.81: 1 -2.54,-7.045; 3 2.54,-7.045 | smd 11 x 9.65: 2 0,4.125
SOT23 = smd 1 x 1.4: 1 -0.95,-1.1; 2 0.95,-1.1; 3 0,1.1
SOT23-3 = smd 0.8 x 0.9: 1 -0.95,-1; 2 0.95,-1; 3 0,1
SOT23-3' = smd 0.8 x 0.9: 1 -0.95,-1; 2 0.95,-1; 3 0,1.1
R0805 = smd 1.397 x 1.016: 1 0,0.889; 2 0,-0.889
R2512 = smd 2.032 x 3.302: 1 -3.175,0; 2 3.175,0
2512 = smd 3 x 3.5: 1 -2.25,0; 2 2.25,0
R0805' = smd 1.397 x 1.016: 1 0,0.889; 2 0,-0.889 | smd 0.406 x 0.813: 3 0,0
SKHMPXE010 = smd 1.6 x 1.4: 1 -4.2,2.25; 2 4.2,2.25; 3 -4.2,-2.25; 4 4.2,-2.25; 5 4.2,0
PW20 = smd 1.676 x 0.356: 1 -2.819,2.925; 2 -2.819,2.275; 3 -2.819,1.625; 4 -2.819,0.975; 5 -2.819,0.325; 6 -2.819,-0.325; 7 -2.819,-0.975; 8 -2.819,-1.625; 9 -2.819,-2.275; 10 -2.819,-2.925; 11 2.819,-2.925; 12 2.819,-2.275; 13 2.819,-1.625; 14 2.819,-0.975; 15 2.819,-0.325; 16 2.819,0.325; 17 2.819,0.975; 18 2.819,1.625; 19 2.819,2.275; 20 2.819,2.925
DBT30 = smd 1.676 x 0.279: 1 -2.819,3.5; 2 -2.819,3; 3 -2.819,2.5; 4 -2.819,2; 5 -2.819,1.5; 6 -2.819,1; 7 -2.819,0.5; 8 -2.819,0; 9 -2.819,-0.5; 10 -2.819,-1; 11 -2.819,-1.5; 12 -2.819,-2; 13 -2.819,-2.5; 14 -2.819,-3; 15 -2.819,-3.5; 16 2.819,-3.5; 17 2.819,-3; 18 2.819,-2.5; 19 2.819,-2; 20 2.819,-1.5; 21 2.819,-1; 22 2.819,-0.5; 23 2.819,0; 24 2.819,0.5; 25 2.819,1; 26 2.819,1.5; 27 2.819,2; 28 2.819,2.5; 29 2.819,3; 30 2.819,3.5
TQFP32-08 = smd 1.27 x 0.559: 1 -4.293,2.8; 2 -4.293,2; 3 -4.293,1.2; 4 -4.293,0.4; 5 -4.293,-0.4; 6 -4.293,-1.2; 7 -4.293,-2; 8 -4.293,-2.8; 17 4.293,-2.8; 18 4.293,-2; 19 4.293,-1.2; 20 4.293,-0.4; 21 4.293,0.4; 22 4.293,1.2; 23 4.293,2; 24 4.293,2.8 | smd 0.559 x 1.27: 9 -2.8,-4.293; 10 -2,-4.293; 11 -1.2,-4.293; 12 -0.4,-4.293; 13 0.4,-4.293; 14 1.2,-4.293; 15 2,-4.293; 16 2.8,-4.293; 25 2.8,4.293; 26 2,4.293; 27 1.2,4.293; 28 0.4,4.293; 29 -0.4,4.293; 30 -1.2,4.293; 31 -2,4.293; 32 -2.8,4.293
SO016 = smd 0.6 x 1.2: 1 -4.445,-2.8; 2 -3.175,-2.8; 3 -1.905,-2.8; 4 -0.635,-2.8; 5 0.635,-2.8; 6 1.905,-2.8; 7 3.175,-2.8; 8 4.445,-2.8; 9 4.445,2.8; 10 3.175,2.8; 11 1.905,2.8; 12 0.635,2.8; 13 -0.635,2.8; 14 -1.905,2.8; 15 -3.175,2.8; 16 -4.445,2.8
DDC6-M = smd 1.626 x 0.61: 1 -1.27,0.95; 2 -1.27,0; 3 -1.27,-0.95; 4 1.27,-0.95; 5 1.27,0; 6 1.27,0.95
70543-04 = drill 1.016 long: 1 -3.81,0; 2 -1.27,0; 3 1.27,0; 4 3.81,0
X3-SMD-3.6X1.3X0.8MM = smd 0.7 x 1.7: 1 -1.2,0; 2 0,0; 3 1.2,0

### Placement (x,y rotation side)
+5V  96.52,43.18 0 top
ALERT  25.4,52.07 0 top
C1  35.18,38.35 0 top
C2  32.13,38.35 0 top
C3  29.08,38.35 0 top
C4  39.37,46.99 90 top
C5  36.88,49.71 90 top
C6  32.13,50.8 0 top
C7  11.43,48.26 0 bottom
C8  11.43,43.18 0 bottom
C9  11.43,38.1 0 bottom
C10  11.43,33.02 0 bottom
C11  85.09,14.48 90 bottom
C12  85.09,10.67 90 bottom
C13  34.29,26.67 180 bottom
C14  39.37,26.67 180 bottom
C15  55.88,53.34 90 bottom
C16  52.07,41.91 270 top
C17  62.23,52.07 90 top
C18  79.96,41.15 270 top
C19  88.9,34.04 90 top
C20  92.71,44.45 90 bottom
C21  86.36,49.53 270 top
C22  82.93,59.97 180 top
C23  85.09,56.77 180 top
C24  77.47,31.75 270 top
C25  10.92,52.07 270 top
CHG  37.59,34.04 0 top
D1  21.59,54.61 180 bottom
D2  55.88,38.1 0 top
D3  16.51,12.7 270 top
D4  81.28,12.7 90 top
D5  64.77,31.75 270 top
D6  49.53,59.69 270 top
D7  44.45,59.69 270 top
D8  39.37,59.69 270 top
D9  34.29,59.69 270 top
D10  29.21,59.69 270 top
D11  24.13,44.45 180 top
D12  24.13,38.1 180 top
D13  24.13,31.75 180 top
D14  87.63,44.45 90 bottom
D15  80.01,63.5 270 top
D16  83.82,63.5 270 top
D17  76.2,63.5 90 top
DSG  38.61,29.34 0 top
GND  96.52,38.1 90 top
J1  6.35,57.15 0 top
J2  6.35,49.53 90 top
J3  91.44,10.16 180 top
J4  7.62,10.16 180 top
J5  6.35,59.69 0 top
J6  90.17,54.61 270 top
L1  85.09,39.37 270 top
PT1  7.62,26.67 0 top
PT2  7.62,26.67 0 bottom
Q1  38.99,19.3 270 top
Q2  66.04,19.3 90 top
Q3  40.64,36.83 180 top
Q4  54.61,30.48 270 top
Q5  PMBT3906  [SOT23-3']  60.2,34.29 0 top
Q6  44.45,48.26 270 top
Q7  48.26,52.07 90 top
Q8  BSS214NH6327  [SOT23-3']  24.13,48.26 180 top
Q9  BSS214NH6327  [SOT23-3']  24.13,41.91 180 top
Q10  BSS214NH6327  [SOT23-3']  24.13,35.56 180 top
Q11  71.12,48.26 180 bottom
Q12  66.04,48.26 180 bottom
Q13  33.02,62.23 270 bottom
R1  34.29,29.21 90 top
R2  33.78,35.56 180 top
R3  30.48,35.56 180 top
R4  39.37,44.45 180 bottom
R5  44.45,44.45 180 bottom
R6  26.67,39.37 180 bottom
R7  15.24,55.88 90 bottom
R8  33.02,57.15 180 bottom
R9  26.67,54.61 270 bottom
R10  21.59,49.53 90 bottom
R11  16.51,48.26 0 bottom
R12  16.51,43.18 0 bottom
R13  16.51,38.1 0 bottom
R14  16.51,33.02 0 bottom
R15  16.51,46.99 180 top
R16  16.51,40.64 180 top
R17  16.51,34.29 180 top
R18  25.53,23.75 180 top
R19  15.24,59.69 90 bottom
R20  48.26,36.83 0 top
R21  69.85,31.75 180 top
R22  44.45,36.83 0 top
R23  53.34,34.29 90 top
R24  58.42,30.48 0 top
R25  45.72,30.48 180 top
R26  55.88,41.91 180 top
R27  53.34,54.61 90 top
R28  44.45,54.61 270 top
R29  39.37,54.61 270 top
R30  48.26,45.72 180 top
R31  48.26,41.91 180 top
R32  48.26,55.88 90 bottom
R33  48.26,59.69 90 bottom
R34  67.31,54.61 0 top
R35  3.81,54.61 180 bottom
R36  [R0805']  49.53,63.5 180 top
R37  [R0805']  44.45,63.5 180 top
R38  [R0805']  39.37,63.5 180 top
R39  [R0805']  34.29,63.5 180 top
R40  [R0805']  29.21,63.5 180 top
R41  66.04,41.91 90 bottom
R42  66.04,54.61 180 bottom
R43  71.12,41.91 90 bottom
R44  71.12,54.61 180 bottom
R45  78.74,53.34 90 bottom
R46  78.74,49.53 90 bottom
R47  80.01,63.5 180 bottom
R48  83.82,63.5 180 bottom
R49  38.1,62.23 180 bottom
R50  92.33,30.48 180 top
R51  92.33,34.29 180 top
R52  76.2,63.5 180 bottom
REGOUT  15.24,52.07 0 top
S1  21.59,62.23 0 top
S2  57.15,62.23 0 top
S3  68.58,62.23 0 top
SCL  44.45,40.64 0 top
SDA  39.75,40.64 0 top
SMBC  71.12,40.64 0 top
SMBC_MCU  71.12,46.99 0 top
SMBD  66.04,40.64 0 top
SMBD_MCU  66.04,46.99 0 top
U1  32.13,44.81 180 top
U2  55.88,48.26 90 top
U3  78.74,52.07 45 top
U4  86.36,53.34 90 bottom
U5  85.09,31.75 0 top
X1  6.35,38.1 90 top
Y1  78.74,58.42 90 bottom
Y2  74.93,44.83 315 top

### Tracks (layer width: path | path; a pad name or v marks a point on that pad's centre or on a via)
+5V  (via drill 0.35)
  Top 0.254: 80.61,43.85 78.74,45.72 78.74,48.26 78.23,48.77 | 78.23,48.77 77.71,49.29 | 77.71,49.29 77.09,49.91 76.02,49.91 U3.4 75.35,49.32 74.68,48.64 72.39,48.64 R34.2 68.58,53.72 69.09,54.23 v69.09,55.5 v69.09,58.42 | U3.6 76.61,48.19 77.71,49.29 | U3.18 78.27,48.77 78.23,48.77 | +5V.TP 95.25,41.91 92.33,41.91
  Top 0.305: L1.1 85.09,44.45 | 85.09,44.45 81.2,44.45 80.61,43.85 79.96,43.2 C18.1 | 85.09,44.45 89.79,44.45 92.33,41.91 R51.2 | 85.09,44.45 v85.09,45.72
  Bottom 0.254: v85.09,45.72 86.54,44.27 D14.C | R44.2 v69.09,55.5 R42.2 | R19.1 16.13,63.12 17.78,64.77 62.23,64.77 68.58,58.42 v69.09,58.42
ALERT  (via drill 0.35)
  Top 0.254: U1.20 29.31,40.92 v29.34,40.89 | U2.2 v52.88,46.89 | v27.94,52.07 ALERT.TP
  Bottom 0.254: v29.34,40.89 28.7,40.26 R6.2 | v52.88,46.89 52.88,46.18 54.61,44.45 54.61,42.47 53.09,40.95 29.39,40.95 v29.34,40.89 | v29.34,40.89 29.21,41.02 29.21,48.26 27.94,49.53 v27.94,52.07
BATT+  (via drill 0.35, 0.6)
  Top 0.254: Q6.2 42.23,47.31 41.02,48.51 41.02,50.42 38.48,52.96 R29.2 20.95,54.61 R15.2
  Top 0.305: U5.5 v87.63,31.75
  Top 0.406: R15.2 10.16,46.99 6.35,43.18 X1.4
  Top 1.27: v82.93,28.96 82.93,27.56 85.09,25.4 95.38,25.4 97.28,23.5 97.28,10.94 | 97.28,10.94 97.28,10.92 97.33,10.92 97.35,10.94 97.28,10.94
  Bottom 0.254: X1.4 6.35,46.23 10.03,49.91 13.21,49.91 13.97,49.15 R11.1 18.67,49.15 19.05,49.53 R10.2 20.7,51.69 19.62,52.77 D1.A
  Bottom 0.305: v87.63,31.75 87.63,29.21 87.38,28.96 v82.93,28.96
  Bottom 0.813: X1.4 3.81,41.91 2.54,40.64 v2.54,11.43
  other vias: 74.8,6.3 74.8,10.87 74.8,9.35 74.8,7.82 74.8,4.78 74.8,3.23 74.8,1.7 69.72,6.3 69.72,10.87 69.72,9.35 69.72,7.82 69.72,4.78 69.72,3.23 69.72,1.7 64.64,6.3 64.64,10.87 64.64,9.35 64.64,7.82 64.64,4.78 64.64,3.23 64.64,1.7 31.62,6.3 31.62,10.87 31.62,9.35 31.62,7.82 31.62,4.78 31.62,3.23 31.62,1.7 21.46,6.3 21.46,10.87 21.46,9.35 21.46,7.82 21.46,4.78 21.46,3.23 21.46,1.7 26.54,6.3 26.54,10.87 26.54,9.35 26.54,7.82 26.54,4.78 26.54,3.23 26.54,1.7
  pour Top (isolate 0.61, no thermals): 0,10.16 arc90 10.16,0 88.9,0 arc90 99.06,10.16 99.06,11.94 0,11.94
  pour Bottom (isolate 0.61, no thermals): 0,10.16 arc90 10.16,0 88.9,0 arc90 99.06,10.16 99.06,11.94 0,11.94
  pour Top: 74.68,27.99 74.68,31.11 84.58,31.11 84.45,30.99 84.45,27.99
BATT-  (via drill 0.35, 0.6)
  Top 0.254: R18.2 25.02,23.75 25.15,23.88 25.15,27.94 30.48,33.27 R3.1
  other vias: 5.71,24.77 5.71,23.88 6.6,23.37 7.62,23.37 8.64,23.37 9.53,23.88 9.53,24.77 17.35,24.26 20.4,24.26 18.87,24.26 15.82,24.26 14.27,24.26 12.75,24.26 17.35,19.18 23.44,19.18 21.92,19.18 20.4,19.18 18.87,19.18 15.82,19.18 14.27,19.18 12.75,19.18 17.35,14.1 23.44,14.1 21.92,14.1 20.4,14.1 18.87,14.1 15.82,14.1 14.27,14.1 12.75,14.1
  pour Top (isolate 0.61, no thermals): 0,25.4 0,13.21 24.38,13.21 24.38,25.4
  pour Bottom (isolate 0.61, no thermals): 0,25.4 0,13.21 24.38,13.21 24.38,25.4
BOOT  (via drill 0.35)
  Top 0.254: v71.12,57.15 71.12,52.07 72.17,51.02 U3.1
  Bottom 0.254: Q13.1 38.04,63.18 R49.2 38.48,63.5 60.96,63.5 67.31,57.15 v71.12,57.15
CHG
  Top 0.254: Q3.2 39.52,38.1 38.1,38.1 | 38.1,38.1 37.34,38.86 37.34,41.78 36.59,42.53 U1.2 | CHG.TP 38.1,34.54 38.1,38.1
DSG
  Top 0.254: R1.2 35.18,25.08 Q1.1 | U1.1 35.18,41.65 R1.2 | DSG.TP 38.48,29.21 R1.2
DSG-CHG  (via drill 0.6)
  Top 1.016: R25.2 42.55,19.87 Q1.2
  other vias: 48.95,24.66 50.72,24.66 52.5,24.66 54.28,24.66 56.06,24.66 52.5,22.89 48.95,22.89 50.72,22.89 54.28,22.89 56.06,22.89 54.28,21.11 52.5,21.11 48.95,21.11 50.72,21.11 56.06,21.11 56.06,19.33 54.28,19.33 52.5,19.33 48.95,19.33 50.72,19.33 48.95,17.55 50.72,17.55 52.5,17.55 54.28,17.55 56.06,17.55 48.95,15.77 50.72,15.77 54.28,14 52.5,14 48.95,14 50.72,14 54.28,15.77 56.06,15.77 52.5,15.77 56.06,14
  pour Top (isolate 0.61, no thermals): 38.23,13.21 38.23,25.4 66.67,25.4 66.67,13.21
  pour Bottom (isolate 0.61, no thermals): 38.23,13.21 38.23,25.4 66.67,25.4 66.67,13.21
GND  (via drill 0.35)
  other vias: 5.71,28.57 5.71,29.46 6.6,29.97 7.62,29.97 8.64,29.97 9.53,29.46 9.53,28.57 75.95,35.43 76.83,35.43 77.72,35.43 78.61,35.43 78.61,39.12 79.5,39.12 80.39,39.12 81.28,39.12 60.58,50.55
  pour Top (isolate 0.26, rank 6): 0,27.94 0,58.42 arc-90 10.16,68.58 88.9,68.58 arc-90 99.06,58.42 99.06,27.94
  pour Bottom (isolate 0.26, rank 6): 0,27.94 0,58.42 arc-90 10.16,68.58 88.9,68.58 arc-90 99.06,58.42 99.06,27.94
N$1
  Top 0.254: R3.2 29.98,36.95 C3.2 | C2.1 C3.2 | C3.2 29.34,39 29.34,39.75 27.81,41.27 27.81,42.8 28.2,43.18 U1.18
N$2
  Top 0.254: R2.2 34.28,36.95 C1.1 C2.2 31.75,39.63 31.75,41.91 31.13,42.53 U1.19
N$3  (via drill 0.35)
  Top 0.254: v31.75,45.72 32.34,45.13 U1.6 | J1.2 8.89,54.61 10.53,52.97 C25.1
  Bottom 0.254: J1.2 10.16,58.42 26.67,58.42 31.75,53.34 | 31.75,53.34 v31.75,45.72 | R8.1 33.02,53.9 32.46,53.34 31.75,53.34
N$4  (via drill 0.35)
  Top 0.254: U1.9 U1.10 34.95,49.38 C6.2 33.53,52.19 32.51,53.21 v29.97,53.21
  Bottom 0.254: R9.2 28.57,54.61 v29.97,53.21
N$5
  Top 0.254: U1.7 34.97,45.8 37.9,45.8 38.19,46.09 C4.1
N$6  (via drill 0.35)
  Top 0.254: J6.4 86.22,52.21 85.09,53.34 v85.09,55.24
  Bottom 0.254: v85.09,55.24 U4.6
N$7  (via drill 0.35)
  Top 0.254: J6.3 86.69,53.01 86.36,53.34 v86.36,53.98
  Bottom 0.254: v86.36,53.98 U4.5
N$8
  Bottom 0.254: J2.2 J1.1
N$9
  Bottom 0.254: R7.2 12.7,55.88 J1.3
N$10
  Bottom 0.254: R10.1 23.55,50.61 D1.C R9.1
N$11  (via drill 0.35)
  Top 0.254: S1.4 v21.59,59.98 S1.3
  Bottom 0.254: 33.02,59.94 R8.2 | 33.02,59.94 33.02,60.28 Q13.2 | v21.59,59.98 32.98,59.98 33.02,59.94
N$12
  Top 0.254: Q10.2 24.18,35.56 24.64,35.56 25.02,35.18 25.02,33.27 24.64,32.89 23.62,32.89 22.98,32.25 D13.A
  Top 0.406: X1.1 10.16,30.48 21.71,30.48 D13.A
  Bottom 0.254: X1.1 15.24,34.29 15.62,33.91 R14.1
N$13  (via drill 0.35)
  Top 0.254: U1.12 27.72,47.08 v27.43,47.37
  Bottom 0.254: v27.43,47.37 R11.2 13.22,47.37 C7.1
N$14
  Top 0.406: Q8.3 19.86,47.16 R15.1
N$15  (via drill 0.35)
  Top 0.254: D15.+ 79.25,64.39 v78.36,63.5
  Bottom 0.254: v78.36,63.5 79.25,62.61 R47.1
N$16  (via drill 0.35)
  Top 0.254: U1.17 27.96,43.83 26.67,42.55 26.67,38.15 Q10.1 25.78,35.86 25.78,32.38 25.28,31.88 D13.C 22.87,29.34 v17.91,29.34
  Bottom 0.254: v17.91,29.34 16.51,30.73 R14.2 13.22,32.13 C10.1
N$17
  Bottom 0.254: J5.3 R19.2
N$18  (via drill 0.35)
  Top 0.254: Q8.2 23.18,49.21 24.13,48.26 24.77,48.26 25.4,47.62 25.4,46.23 24.77,45.59 23.62,45.59 22.98,44.95 D11.A 22.73,44.7 v21.34,44.7
  Top 0.406: R16.2 12.06,39.37 X1.3
  Bottom 0.254: X1.3 8.89,41.91 8.89,44.45 9.65,45.21 15.62,45.21 16.51,44.32 R12.1 18.92,44.07 19.56,44.7 v21.34,44.7
N$19
  Top 0.406: R16.1 19.86,40.81 Q9.3
N$20  (via drill 0.35)
  Top 0.254: R20.1 50.42,37.72 52.58,39.88 53.47,39.88 53.85,40.26 53.85,41.15 54.61,41.91 57.15,41.91 57.78,41.27 57.78,38.16 D2.C 66.04,38.1 69.85,34.29 R21.2 68.83,32.64 67.82,31.62 v67.82,28.32 | v69.22,16.76 Q2.1
  Bottom 0.254: v67.82,28.32 67.82,18.16 v69.22,16.76
N$21  (via drill 0.35)
  Top 0.254: 26.04,45.13 25.87,45.13 D11.C 25.15,44.45 24.38,43.69 v20.83,43.69 | 26.04,45.13 U1.15 U1.14 U1.13 | Q8.1 26.04,48.3 26.04,45.13
  Bottom 0.254: v20.83,43.69 19.43,42.29 R12.2 13.22,42.29 C8.1
N$22
  Top 0.406: R17.1 19.05,34.42 20.74,34.46 Q10.3
N$23  (via drill 0.35)
  Top 0.254: U2.27 53.88,52.8 v53.72,52.96
  Bottom 0.254: v53.72,52.96 55.36,52.96 C15.1
N$24
  Bottom 0.254: C11.1 C12.2
N$26
  Top 0.254: R22.1 45.34,37.72 47.12,35.94 R20.2 49.91,35.94 52.07,38.1 D2.A
N$27  (via drill 0.35)
  Top 0.254: Q9.2 23.18,42.86 24.13,41.91 24.64,41.91 25.15,41.4 25.15,39.88 24.51,39.24 23.62,39.24 22.98,38.6 D12.A 22.09,38.99 v21.84,38.99 | X1.2 3.81,36.83 2.54,38.1 2.54,60.96 7.62,66.04 15.83,66.04 S1.1 | S1.1 S1.2 | S1.1 17.78,64.09 v17.78,62.23
  Top 0.406: R17.2 10.79,36.83 X1.2
  Bottom 0.254: X1.2 8.89,39.37 13.97,39.37 14.35,38.99 R13.1 v21.84,38.99 | v17.78,62.23 Q13.3
N$28
  Top 0.254: Q3.3 44.24,35.73 R22.2
N$29
  Bottom 0.254: C13.2 C14.1
N$30
  Top 0.254: R24.1 53.67,31.37 Q4.1 54.23,32.05 R23.2
N$31
  Top 0.254: D5.C 58.61,29.79 R24.2
N$32
  Top 0.254: Q5.3 60.2,32.64 60.71,32.13 63.19,32.13 D5.A
N$33
  Top 0.254: R26.1 55.88,34.88 57.47,33.29 Q5.1
N$34
  Top 0.406: R25.1 Q4.3
N$35
  Top 0.254: U2.12 57.88,47.15 56.9,48.13 50.93,48.13 49.28,49.78 49.28,51.1 Q7.1 50.8,52.66 50.8,53.34 52.07,54.61 R27.1
N$36
  Top 0.254: R28.1 46.35,54.61 47.26,53.7 Q7.3
N$37
  Top 0.254: R29.1 R28.2 43.56,49.42 Q6.1
N$38
  Top 0.254: R30.2 46.61,48.26 Q6.3
N$39
  Top 0.254: 52.08,42.8 C16.1 48.27,42.81 R31.2 R30.1 49.91,44.83 50.8,45.72 50.8,47.24 51.18,47.62 54.74,47.62 55.38,46.98 U2.7
N$40  (via drill 0.35)
  Top 0.254: v55.37,55.63 U2.24
  Bottom 0.254: R32.1 49.53,55.88 50.8,54.61 54.36,54.61 v55.37,55.63
N$41
  Top 0.254: U2.16 59.38,56.83 58.1,58.1 | 58.1,58.1 58.04,58.17 | 58.1,58.1 57.78,58.42 50.8,58.42 50.42,58.8 D6.-
N$42
  Top 0.254: D7.- 45.34,57.91 57.4,57.91 58.88,56.44 U2.17
N$43
  Top 0.254: U2.18 58.38,55.92 56.9,57.4 40.77,57.4 D8.-
N$44
  Top 0.254: U2.19 57.88,55.53 56.52,56.9 36.2,56.9 D9.-
N$45
  Top 0.254: U2.20 57.38,55.09 57.4,55.12 56.13,56.39 31.62,56.39 D10.-
N$46
  Top 0.254: R36.1 D6.+
N$47
  Top 0.254: R37.1 D7.+
N$48  (via drill 0.35)
  Top 0.254: U2.14 58.88,46.94 59.31,47.37 62.61,47.37 63.75,48.51 63.75,57.58 S2.4 S2.3 51.22,59.98 v51.18,59.94
  Bottom 0.254: v51.18,59.94 49.4,59.94 R33.1
N$49
  Top 0.254: R38.1 D8.+
N$50
  Top 0.254: R39.1 D9.+
N$51
  Top 0.254: R40.1 D10.+
N$53  (via drill 0.35)
  Top 0.254: D16.+ 83.06,64.39 v82.17,63.5
  Bottom 0.254: v82.17,63.5 82.17,63.37 82.93,62.61 R48.1
N$55  (via drill 0.35)
  Top 0.254: C22.1 84.77,60.96 91.44,60.96 92.71,59.69 92.71,57.15 91.72,56.16 91.72,53.34 92.35,52.7 v92.46,52.7
  Bottom 0.254: v92.46,52.7 U4.13
N$56
  Top 0.254: 67.31,59.98 S3.3 | 67.31,59.98 S3.4 | S3.4 C22.2 | S3.4 73.66,59.1 73.66,56.58 U3.29 | R34.1 67.31,59.98
N$57
  Bottom 0.254: J5.1 5.08,59.69 3.81,58.42 R35.2
N$58
  Bottom 0.254: U4.7 82.87,57.21 82.84,57.21 82.83,57.22 Y1.1
N$59
  Bottom 0.254: U4.8 81.72,59.62 Y1.3
N$60
  Bottom 0.254: U4.3 82.87,52.13 82.84,52.13 81.63,53.34 R45.1
N$61
  Top 0.254: Y2.3 76.96,45.17 76.96,46.35 77.66,47.05 U3.8
N$62
  Top 0.254: Y2.1 75.27,46.86 76.33,46.86 77.08,47.62 U3.7
N$63
  Bottom 0.254: U4.2 82.92,49.53 R46.1
N$64  (via drill 0.35)
  Top 0.254: v77.22,51.82 76.17,51.82 U3.31 | v80.01,60.96 D15.-
  Bottom 0.254: v77.22,51.82 77.85,52.45 R45.2 77.85,55.5 76.96,56.39 76.96,60.58 77.34,60.96 v80.01,60.96
N$65  (via drill 0.35)
  Top 0.254: U3.30 74.9,54.26 75.56,53.59 75.95,53.59 v76.2,53.34 78.74,55.88 78.74,57.15 | 78.74,57.15 78.74,57.53 | 78.74,57.15 78.74,57.53 | D16.- 83.82,61.45 82.95,60.59 82.95,59.33 82.17,58.55 79.76,58.55 78.74,57.53
  Bottom 0.254: R46.2 76.2,51.18 v76.2,53.34
N$66
  Top 0.254: U3.20 84.24,57 C23.2
N$67  (via drill 0.35)
  Top 0.254: U1.16 26.65,44.48 Q9.1 25.91,42.08 25.91,38.73 D12.C 24.52,37.34 v20.83,37.34
  Bottom 0.254: v20.83,37.34 20.7,37.21 R13.2 13.22,37.21 C9.1
N$68
  Top 0.305: U5.4 90.11,30.8 90.68,31.37 R50.2 R51.1
N$70
  Top 0.305: C19.1 88.03,33.14 87.61,32.72 86.38,32.72 U5.6
N$71  (via drill 0.35)
  Top 0.254: U3.9 80.01,46.84 v80.01,45.72
  Bottom 0.254: v80.01,45.72 78.74,45.72 74.93,49.53 74.93,54.1 75.95,55.12 75.95,60.07 73.79,62.23 73.79,63.75 74.42,64.39 R52.2
N$72  (via drill 0.35)
  Top 0.254: v74.68,62.61 D17.+
  Bottom 0.254: D17.+ v74.68,62.61
PACK-  (via drill 0.35, 0.6)
  Top 0.254: R23.1 48.26,34.29 45.72,31.75 45.72,29.21 48.26,26.67 v53.6,26.67 | R21.1 69.85,26.67
  Top 0.406: Q4.2 v53.6,26.67 69.85,26.67 70.43,26.09 v70.43,24.26
  Bottom 0.254: C14.2 v53.6,26.67
  other vias: 71.96,24.26 78.05,24.26 76.53,24.26 75.01,24.26 73.48,24.26 71.96,19.46 78.05,19.46 76.53,19.46 75.01,19.46 73.48,19.46 70.43,19.46 71.96,14.3 78.05,14.3 76.53,14.3 75.01,14.3 73.48,14.3 70.43,14.3 78.05,21.87 76.53,21.87 78.05,16.79 76.53,16.79
  pour Top (isolate 0.61, no thermals): 99.06,25.4 69.34,25.4 69.34,13.21 99.06,13.21
  pour Bottom (isolate 0.61, no thermals): 99.06,25.4 69.34,25.4 69.34,13.21 99.06,13.21
PRECHG
  Top 0.254: U2.5 54.38,44.45 | 54.38,44.45 54.38,44.3 | 54.38,44.45 54.38,43.28 54.86,42.8 R26.2
REGOUT  (via drill 0.35)
  Top 0.254: U1.8 34.96,46.44 v36.58,46.44 36.88,46.75 C5.1 | 36.58,64.36 v36.58,59.56 | 34.31,64.36 R39.2 | 39.34,64.36 R38.2 | R38.2 R37.2 46.99,64.39 | R39.2 R40.2 28.07,64.39 27.81,64.14 27.81,58.8 26.16,57.15 19.05,57.15 15.24,53.34 REGOUT.TP | 46.99,64.39 R36.2 | 46.99,64.39 v46.99,62.23 | v53.34,55.78 54.23,54.89 R27.2 54.38,54.46 U2.26 54.38,49.63 54.74,49.28 61.73,49.28 | Q5.2 62.23,34.37 v62.23,35.56 | v62.23,48.77 61.73,49.27 61.73,49.28 | C17.1 61.73,50.67 61.73,49.28 | R38.2 36.6,64.39 36.58,64.36 | R39.2 36.55,64.39 36.58,64.36
  Bottom 0.254: R5.2 R4.2 37.68,45.34 v36.58,46.44 v36.58,59.56 | v46.99,62.23 46.99,61.42 47.37,61.04 R33.2 47.37,57.15 | 47.37,57.15 R32.2 | v53.34,55.78 52.17,55.78 50.8,57.15 47.37,57.15 | 65.15,38.48 v62.23,35.56 | 65.15,38.48 R41.2 65.09,41.97 Q12.1 62.72,49.26 v62.23,48.77 | 65.15,38.48 66.8,38.48 R43.2 70.17,41.97 Q11.1
RSNS-DSG  (via drill 0.6)
  Top 0.254: 33.02,33.02 31.11,33.02 25.91,27.81 25.91,23.88 26.04,23.75 R18.1 | 33.02,33.02 33.78,33.78 R2.1 | R1.1 33.02,29.59 33.02,33.02
  Bottom 0.254: C13.1 32.54,26.67 31.77,25.91 v31.77,24.49
  other vias: 28.78,14.1 34.87,14.1 33.35,14.1 31.83,14.1 30.3,14.1 27.25,14.1 27.25,16.64 28.78,16.64 27.25,19.18 28.78,19.18 30.3,19.18 31.83,19.18 33.35,19.18 34.87,19.18 30.25,24.49
  pour Top (isolate 0.61, no thermals): 26.42,25.4 35.69,25.4 35.69,13.21 26.42,13.21
  pour Bottom (isolate 0.61, no thermals): 26.42,25.4 35.69,25.4 35.69,13.21 26.42,13.21
SCL  (via drill 0.35)
  Top 0.254: U1.5 38.09,44.48 39.39,43.17 v41.91,43.17 | v41.91,43.17 v41.91,43.18 | U2.4 v53.88,46.88 v53.87,46.89 | SCL.TP v41.91,43.17
  Bottom 0.254: v41.91,43.18 44.07,43.18 R5.1 48.7,43.56 52.63,47.49 53.13,47.49 53.74,46.89 v53.87,46.89
SDA  (via drill 0.35)
  Top 0.254: U1.4 34.97,43.81 v36.68,43.81 37.59,43.81 39.75,41.66 SDA.TP | U2.3 53.38,44 v53.39,43.99
  Bottom 0.254: v36.68,43.81 36.93,43.56 R4.1 41.02,41.91 48.26,41.91 50.34,43.99 v53.39,43.99
SMBC  (via drill 0.35)
  Top 0.254: U2.13 58.38,44.49 59.05,43.81 60.33,43.81 60.96,44.45 69.85,44.45 v71.12,43.18 SMBC.TP
  Bottom 0.254: Q11.2 72.01,49.2 72.01,43.18 | 72.01,43.18 R43.1 | 72.01,43.18 v71.12,43.18
SMBC_MCU  (via drill 0.35)
  Top 0.254: v75.06,56.26 75.11,56.26 U3.28 | SMBC_MCU.TP v71.12,48.9
  Bottom 0.254: Q11.3 v71.12,48.9 R44.1 72.52,53.72 v75.06,56.26
SMBD  (via drill 0.35)
  Top 0.254: U2.11 57.38,43.84 58.04,43.18 v66.04,43.18 SMBD.TP
  Bottom 0.254: R41.1 66.99,41.97 66.99,43.18 | 66.99,43.18 Q12.2 | 66.99,43.18 v66.04,43.18
SMBD_MCU  (via drill 0.35)
  Top 0.254: v75.14,57.36 v75.15,57.36 U3.27 | SMBD_MCU.TP v66.04,50.8
  Bottom 0.254: Q12.3 v66.04,50.8 R42.1 67.69,53.72 68.58,54.61 72.39,54.61 v75.14,57.36
SW  (via drill 0.35)
  Top 0.61: U5.2 v82.42,31.75 v81.53,31.75
  other vias: 83.74,35.56 86.41,35.56 84.63,35.56 85.52,35.56
  pour Bottom: 88.01,35.81 81.03,35.81 81.03,31.37 82.93,31.37 82.93,34.67 88.01,34.67
  pour Top: 80.64,38.23 80.64,34.54 89.53,34.54 89.53,38.23
TS-SELECT  (via drill 0.35)
  Top 0.254: v83.69,58.8 82.68,57.78 80.52,57.78 79.82,57.09 U3.24
  Bottom 0.254: J5.2 15.24,66.04 76.71,66.04 77.47,65.28 77.47,62.23 78.11,61.59 81.03,61.59 83.69,58.93 v83.69,58.8
USB+  (via drill 0.35)
  Top 0.254: C21.1 86.91,50.38 v87.63,49.66 89.38,51.41 J6.5
  Bottom 0.254: R47.2 R48.2 84.2,64.39 87.63,60.96 v87.63,49.66 88.39,48.9 U4.16 | C20.A 89.92,48.9 U4.16 | D14.A 87.63,46.1 89.15,47.62 U4.16

### Text on the board
tNames: BQ769200 | BQ78350-R1 | TPS562200 | BATTERY / MANAGEMENT / SYSTEM V1